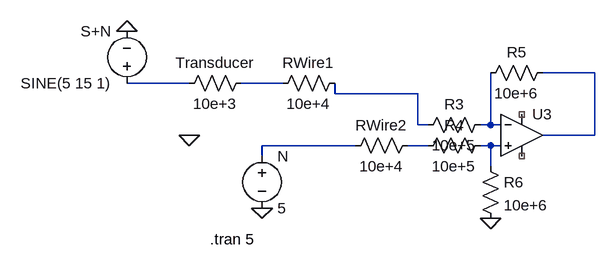
[diagram p0: schematic diff_opamp.asc]
diff_opamp.asc, the LTspice schematic file:
Version 4
SHEET 1 880 680
WIRE 592 112 512 112
WIRE -32 128 -128 128
WIRE 112 128 48 128
WIRE 192 144 192 128
WIRE 320 144 192 144
WIRE 320 192 320 144
WIRE 336 192 320 192
WIRE 432 192 432 112
WIRE 432 192 416 192
WIRE 448 192 432 192
WIRE 592 208 592 112
WIRE 592 208 512 208
WIRE 224 224 80 224
WIRE 336 224 304 224
WIRE 432 224 416 224
WIRE 448 224 432 224
WIRE 80 240 80 224
WIRE 432 256 432 224
FLAG 80 320 0
FLAG -128 48 0
FLAG 432 336 0
FLAG -32 208 0
SYMBOL OpAmps\\UniversalOpAmp1 480 208 R0
SYMATTR InstName U3
SYMBOL voltage -128 144 R180
WINDOW 0 24 96 Left 2
WINDOW 3 24 16 Left 2
WINDOW 123 0 0 Left 0
WINDOW 39 0 0 Left 0
SYMATTR InstName S+N
SYMATTR Value SINE(5 15 1)
SYMBOL voltage 80 224 R0
WINDOW 123 0 0 Left 0
WINDOW 39 0 0 Left 0
SYMATTR InstName N
SYMATTR Value 5
SYMBOL res -48 144 R270
WINDOW 0 32 56 VTop 2
WINDOW 3 0 56 VBottom 2
SYMATTR InstName Transducer
SYMATTR Value 10e+3
SYMBOL res 208 112 R90
WINDOW 0 0 56 VBottom 2
WINDOW 3 32 56 VTop 2
SYMATTR InstName RWire1
SYMATTR Value 10e+4
SYMBOL res 320 208 R90
WINDOW 0 0 56 VBottom 2
WINDOW 3 32 56 VTop 2
SYMATTR InstName RWire2
SYMATTR Value 10e+4
SYMBOL res 432 176 R90
WINDOW 0 0 56 VBottom 2
WINDOW 3 32 56 VTop 2
SYMATTR InstName R3
SYMATTR Value 10e+5
SYMBOL res 432 208 R90
WINDOW 0 0 56 VBottom 2
WINDOW 3 32 56 VTop 2
SYMATTR InstName R4
SYMATTR Value 10e+5
SYMBOL res 416 240 R0
SYMATTR InstName R6
SYMATTR Value 10e+6
SYMBOL res 528 96 R90
WINDOW 0 0 56 VBottom 2
WINDOW 3 32 56 VTop 2
SYMATTR InstName R5
SYMATTR Value 10e+6
TEXT 0 368 Left 2 !.tran 5

The netlist it stands for:
* diff_opamp.asc
XU3 N008 N005 NC_01 NC_02 N001 level1 Avol=1Meg GBW=10Meg Vos=0 En=0 Enk=0 In=0 Ink=0 Rin=500Meg  ; pins In+ In- V+ V- OUT
V§S+N N002 0 SINE(5 15 1)
V§N N006 0 5
R§Transducer N002 N003 10e+3
RWire1 N004 N003 10e+4
RWire2 N007 N006 10e+4
R3 N005 N004 10e+5
R4 N008 N007 10e+5
R6 N008 0 10e+6
R5 N001 N005 10e+6
.tran 5
.lib UniversalOpAmp1.lib
.backanno
.end